# Altium schematic sheet top.SchDoc
size A4
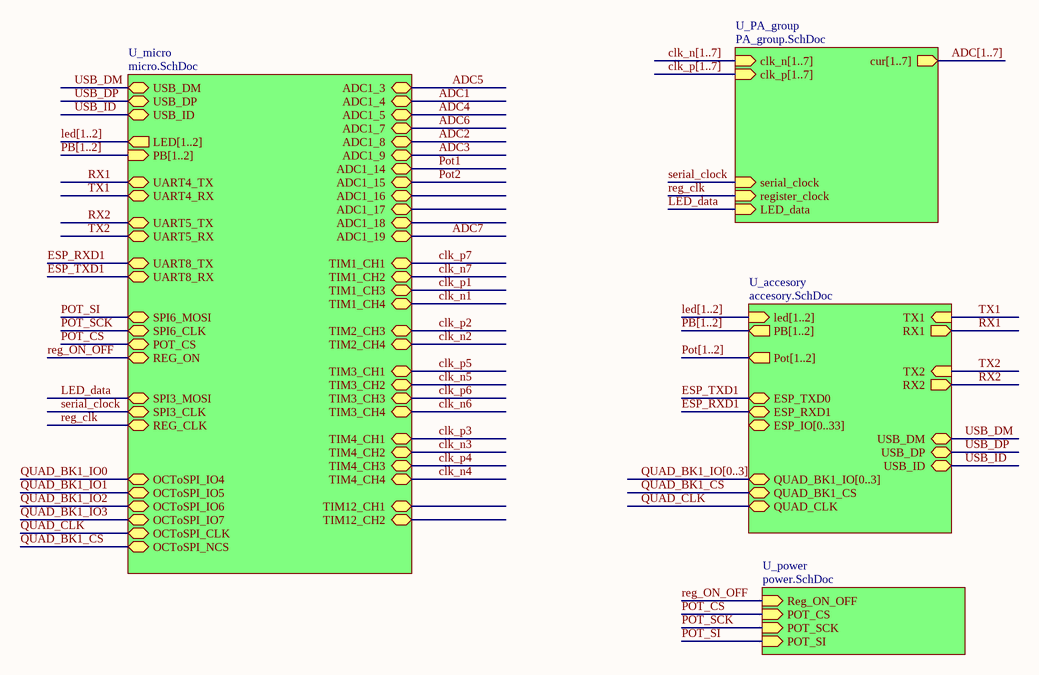
[diagram p0: top.SchDoc]

## Sub-sheets
U_accesory = accesory.SchDoc: led[1..2] (in), PB[1..2] (out), Pot[1..2] (out), RX1 (out), RX2 (out), TX1 (in), TX2 (in), USB_DM (bidir), USB_DP (bidir), USB_ID (bidir), ESP_TXD0 (bidir), ESP_RXD1 (bidir), ESP_IO[0..33] (bidir), QUAD_BK1_IO[0..3] (bidir), QUAD_BK1_CS (bidir), QUAD_CLK (bidir)
U_micro = micro.SchDoc: USB_DM (bidir), USB_DP (bidir), LED[1..2] (out), PB[1..2] (in), UART5_RX (bidir), ADC1_19 (bidir), REG_CLK (bidir), SPI6_MOSI (bidir), UART8_TX (bidir), SPI3_MOSI (bidir), ADC1_4 (bidir), UART4_TX (bidir), ADC1_7 (bidir), UART5_TX (bidir), ADC1_3 (bidir), ADC1_8 (bidir), ADC1_9 (bidir), UART8_RX (bidir), ADC1_5 (bidir), REG_ON (bidir), SPI3_CLK (bidir), SPI6_CLK (bidir), UART4_RX (bidir), ADC1_16 (bidir), TIM1_CH3 (bidir), TIM1_CH4 (bidir), TIM3_CH2 (bidir), TIM4_CH1 (bidir), TIM2_CH4 (bidir), ADC1_18 (bidir), TIM1_CH2 (bidir), ADC1_14 (bidir), TIM3_CH4 (bidir), TIM3_CH3 (bidir), ADC1_17 (bidir), TIM3_CH1 (bidir), TIM4_CH3 (bidir), USB_ID (bidir), TIM4_CH2 (bidir), ADC1_15 (bidir), TIM2_CH3 (bidir), TIM12_CH2 (bidir), TIM1_CH1 (bidir), TIM12_CH1 (bidir), TIM4_CH4 (bidir), POT_CS (bidir), OCToSPI_IO4 (bidir), OCToSPI_IO5 (bidir), OCToSPI_CLK (bidir), OCToSPI_IO7 (bidir), OCToSPI_NCS (bidir), OCToSPI_IO6 (bidir)
U_PA_group = PA_group.SchDoc: serial_clock (in), register_clock (in), LED_data (in), clk_n[1..7] (in), clk_p[1..7] (in), cur[1..7] (out)
U_power = power.SchDoc: Reg_ON_OFF (in), POT_CS (in), POT_SCK (in), POT_SI (in)

## Nets
ADC1: sheet U_micro/ADC1_4
ADC2: sheet U_micro/ADC1_8
ADC3: sheet U_micro/ADC1_9
ADC4: sheet U_micro/ADC1_5
ADC5: sheet U_micro/ADC1_3
ADC6: sheet U_micro/ADC1_7
ADC7: sheet U_micro/ADC1_19
clk_n1: sheet U_micro/TIM1_CH4
clk_n2: sheet U_micro/TIM2_CH4
clk_n3: sheet U_micro/TIM4_CH2
clk_n4: sheet U_micro/TIM4_CH4
clk_n5: sheet U_micro/TIM3_CH2
clk_n6: sheet U_micro/TIM3_CH4
clk_n7: sheet U_micro/TIM1_CH2
clk_p1: sheet U_micro/TIM1_CH3
clk_p2: sheet U_micro/TIM2_CH3
clk_p3: sheet U_micro/TIM4_CH1
clk_p4: sheet U_micro/TIM4_CH3
clk_p5: sheet U_micro/TIM3_CH1
clk_p6: sheet U_micro/TIM3_CH3
clk_p7: sheet U_micro/TIM1_CH1
ESP_RXD1: sheet U_micro/UART8_TX, sheet U_accesory/ESP_RXD1
ESP_TXD1: sheet U_micro/UART8_RX, sheet U_accesory/ESP_TXD0
LED_data: sheet U_micro/SPI3_MOSI, sheet U_PA_group/LED_data
Pot1: sheet U_micro/ADC1_14
Pot2: sheet U_micro/ADC1_15
POT_CS: sheet U_micro/POT_CS, sheet U_power/POT_CS
POT_SCK: sheet U_micro/SPI6_CLK, sheet U_power/POT_SCK
POT_SI: sheet U_micro/SPI6_MOSI, sheet U_power/POT_SI
QUAD_BK1_CS: sheet U_micro/OCToSPI_NCS, sheet U_accesory/QUAD_BK1_CS
QUAD_BK1_IO0: sheet U_micro/OCToSPI_IO4
QUAD_BK1_IO1: sheet U_micro/OCToSPI_IO5
QUAD_BK1_IO2: sheet U_micro/OCToSPI_IO6
QUAD_BK1_IO3: sheet U_micro/OCToSPI_IO7
QUAD_CLK: sheet U_micro/OCToSPI_CLK, sheet U_accesory/QUAD_CLK
reg_clk: sheet U_micro/REG_CLK, sheet U_PA_group/register_clock
reg_ON_OFF: sheet U_micro/REG_ON, sheet U_power/Reg_ON_OFF
RX1: sheet U_micro/UART4_TX, sheet U_accesory/RX1
RX2: sheet U_micro/UART5_TX, sheet U_accesory/RX2
serial_clock: sheet U_micro/SPI3_CLK, sheet U_PA_group/serial_clock
TX1: sheet U_micro/UART4_RX, sheet U_accesory/TX1
TX2: sheet U_micro/UART5_RX, sheet U_accesory/TX2
USB_DM: sheet U_micro/USB_DM, sheet U_accesory/USB_DM
USB_DP: sheet U_micro/USB_DP, sheet U_accesory/USB_DP
USB_ID: sheet U_micro/USB_ID, sheet U_accesory/USB_ID

## Buses and harness runs
bus ADC[1..7] = sheet U_PA_group/cur[1..7]
bus clk_n[1..7] = sheet U_PA_group/clk_n[1..7]
bus clk_p[1..7] = sheet U_PA_group/clk_p[1..7]
bus led[1..2] = sheet U_accesory/led[1..2]
bus led[1..2] = sheet U_micro/LED[1..2]
bus PB[1..2] = sheet U_accesory/PB[1..2]
bus PB[1..2] = sheet U_micro/PB[1..2]
bus Pot[1..2] = sheet U_accesory/Pot[1..2]
bus QUAD_BK1_IO[0..3] = sheet U_accesory/QUAD_BK1_IO[0..3]